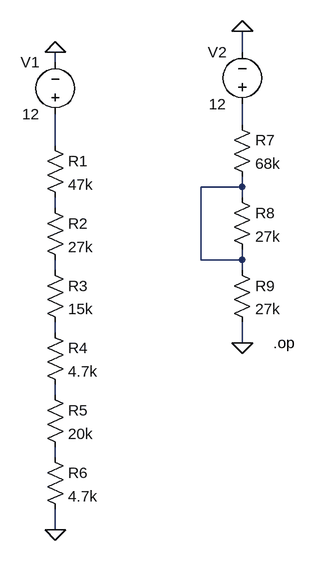
[diagram p0: schematic Draft3.asc]
Draft3.asc, the LTspice schematic file:
Version 4
SHEET 1 880 800
WIRE 464 48 464 16
WIRE 176 64 176 48
WIRE 464 160 464 128
WIRE 176 192 176 144
WIRE 464 256 464 240
WIRE 464 256 400 256
WIRE 464 272 464 256
WIRE 176 288 176 272
WIRE 400 368 400 256
WIRE 464 368 464 352
WIRE 464 368 400 368
WIRE 176 384 176 368
WIRE 464 384 464 368
WIRE 176 480 176 464
WIRE 464 496 464 464
WIRE 176 576 176 560
WIRE 176 672 176 656
WIRE 176 784 176 752
FLAG 176 48 0
FLAG 176 784 0
FLAG 464 16 0
FLAG 464 496 0
SYMBOL voltage 176 160 R180
WINDOW 0 24 96 Left 2
WINDOW 3 24 16 Left 2
SYMATTR InstName V1
SYMATTR Value 12
SYMBOL Res 160 176 R0
SYMATTR InstName R1
SYMATTR Value 47k
SYMBOL Res 160 272 R0
SYMATTR InstName R2
SYMATTR Value 27k
SYMBOL Res 160 368 R0
SYMATTR InstName R3
SYMATTR Value 15k
SYMBOL Res 160 464 R0
SYMATTR InstName R4
SYMATTR Value 4.7k
SYMBOL Res 160 560 R0
SYMATTR InstName R5
SYMATTR Value 20k
SYMBOL Res 160 656 R0
SYMATTR InstName R6
SYMATTR Value 4.7k
SYMBOL Voltage 464 144 R180
WINDOW 0 24 96 Left 2
WINDOW 3 24 16 Left 2
SYMATTR InstName V2
SYMATTR Value 12
SYMBOL Res 448 144 R0
SYMATTR InstName R7
SYMATTR Value 68k
SYMBOL Res 448 256 R0
SYMATTR InstName R8
SYMATTR Value 27k
SYMBOL Res 448 368 R0
SYMATTR InstName R9
SYMATTR Value 27k
TEXT 512 496 Left 2 !.op

The netlist it stands for:
* Draft3.asc
V1 N002 0 12
R1 N002 N004 47k
R2 N004 N005 27k
R3 N005 N006 15k
R4 N006 N007 4.7k
R5 N007 N008 20k
R6 N008 0 4.7k
V2 N001 0 12
R7 N001 N003 68k
R8 N003 N003 27k
R9 N003 0 27k
.op
.backanno
.end